# EAGLE design VCO (EAGLE 7.5.0)
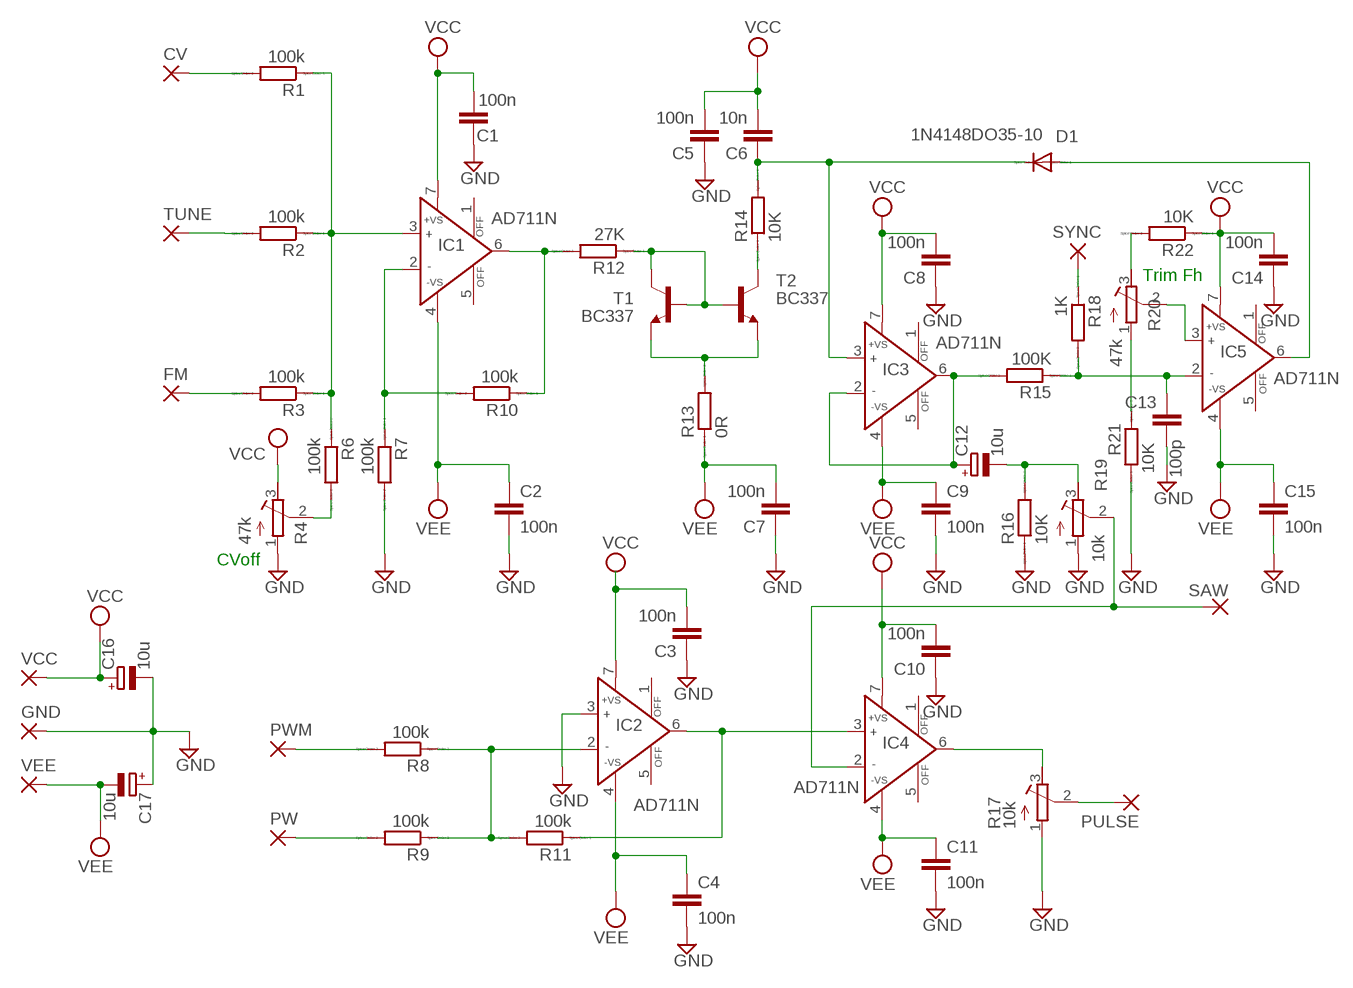
[diagram p0: schematic, sheet 1]

## Parts
C1  100n  C5/2.5  [C5B2.5]
C2  100n  C5/2.5  [C5B2.5]
C3  100n  C5/2.5  [C5B2.5]
C4  100n  C5/2.5  [C5B2.5]
C5  100n  C5/2.5  [C5B2.5]
C6  10n  C5/2.5  [C5B2.5]
C7  100n  C5/2.5  [C5B2.5]
C8  100n  C5/2.5  [C5B2.5]
C9  100n  C5/2.5  [C5B2.5]
C10  100n  C5/2.5  [C5B2.5]
C11  100n  C5/2.5  [C5B2.5]
C12  10u  CPOL-EUE2.5-7  [E2,5-7]
C13  100p  C2.5/2  [C2.5-2]
C14  100n  C5/2.5  [C5B2.5]
C15  100n  C5/2.5  [C5B2.5]
C16  10u  CPOL-EUE2.5-7  [E2,5-7]
C17  10u  CPOL-EUE2.5-7  [E2,5-7]
CV  3,17/1,1  [3,17/1,1]
D1  1N4148DO35-10  [DO35-10]
FM  3,17/1,1  [3,17/1,1]
GND  3,17/1,1  [3,17/1,1]
IC1  AD711N  [DIL08]
IC2  AD711N  [DIL08]
IC3  AD711N  [DIL08]
IC4  AD711N  [DIL08]
IC5  AD711N  [DIL08]
PULSE  3,17/1,1  [3,17/1,1]
PW  3,17/1,1  [3,17/1,1]
PWM  3,17/1,1  [3,17/1,1]
R1  100k  R0207/10  [0207/10]
R2  100k  R0207/10  [0207/10]
R3  100k  R0207/10  [0207/10]
R4  47k  R-TRIMM64W  [RTRIM64W]
R6  100k  R0207/10  [0207/10]
R7  100k  R0207/10  [0207/10]
R8  100k  R0207/10  [0207/10]
R9  100k  R0207/10  [0207/10]
R10  100k  R0207/10  [0207/10]
R11  100k  R0207/10  [0207/10]
R12  27K  R0207/10  [0207/10]
R13  0R  R0207/10  [0207/10]
R14  10K  R0207/10  [0207/10]
R15  100K  R0207/10  [0207/10]
R16  10K  R0207/10  [0207/10]
R17  10k  R-TRIMM3339P  [RTRIM3339P]
R18  1K  R0207/10  [0207/10]
R19  10k  R-TRIMM3339P  [RTRIM3339P]
R20  47k  R-TRIMM64W  [RTRIM64W]
R21  10K  R0207/10  [0207/10]
R22  10K  R0207/10  [0207/10]
SAW  3,17/1,1  [3,17/1,1]
SYNC  3,17/1,1  [3,17/1,1]
T1  BC337  [TO92]
T2  BC337  [TO92]
TUNE  3,17/1,1  [3,17/1,1]
VCC  3,17/1,1  [3,17/1,1]
VEE  3,17/1,1  [3,17/1,1]

## Nets
GND [Power]: C1.1 C2.2 C3.1 C4.2 C5.1 C7.1 C8.1 C9.2 C10.1 C11.2 C13.1 C14.1 C15.2 C16.- C17.+ GND.1(P) IC2.3(IN+) R4.1(A) R7.2 R16.1 R17.1(A) R19.1(A) R21.1
N$1: R12.1 T1.2(B) T1.3(C) T2.2(B)
N$2: R13.2 T1.1(E) T2.1(E)
N$3: C6.1 D1.C IC3.3(IN+) R14.2
N$4: R14.1 T2.3(C)
N$5: D1.A IC5.6(OUT)
N$6: IC5.3(IN+) R20.2(S)
N$7: C13.2 IC5.2(IN-) R15.1 R18.2
N$8: C12.+ IC3.2(IN-) IC3.6(OUT) R15.2
N$9: R20.1(A) R21.2
N$10: R4.2(S) R6.2
N$11: R20.3(E) R22.2
N$12: CV.1(P) R1.2
N$13: IC1.3(IN+) R1.1 R2.1 R3.1 R6.1
N$14: FM.1(P) R3.2
N$15: R18.1 SYNC.1(P)
N$17: R2.2 TUNE.1(P)
N$18: IC1.6(OUT) R10.1 R12.2
N$20: IC1.2(IN-) R7.1 R10.2
N$21: IC4.2(IN-) R19.2(S) SAW.1(P)
N$22: IC4.6(OUT) R17.3(E)
N$23: PULSE.1(P) R17.2(S)
N$24: IC2.2(IN-) R8.1 R9.1 R11.2
N$25: C12.- R16.2 R19.3(E)
N$27: PWM.1(P) R8.2
N$28: PW.1(P) R9.2
N$29: IC2.6(OUT) IC4.3(IN+) R11.1
VCC [Power]: C1.2 C3.2 C5.2 C6.2 C8.2 C10.2 C14.2 C16.+ IC1.7(+VS) IC2.7(+VS) IC3.7(+VS) IC4.7(+VS) IC5.7(+VS) R4.3(E) R22.1 VCC.1(P)
VEE [Power]: C2.1 C4.1 C7.2 C9.1 C11.1 C15.1 C17.- IC1.4(-VS) IC2.4(-VS) IC3.4(-VS) IC4.4(-VS) IC5.4(-VS) R13.1 VEE.1(P)
Unconnected: IC1.1(OFF) IC1.5(OFF) IC2.1(OFF) IC2.5(OFF) IC3.1(OFF) IC3.5(OFF) IC4.1(OFF) IC4.5(OFF) IC5.1(OFF) IC5.5(OFF)

## Notes on the sheet
- Trim Fh
- CVoff

## Library data of the parts
C1-C11 C13-C15 = capacitor-wima:C: CAPACITOR naming: grid - package width
C12 C16 C17 = rcl:CPOL-EU: POLARIZED CAPACITOR, European symbol
CV FM GND PULSE PW PWM SAW SYNC TUNE VCC VEE = wirepad:3,17/1,1: THROUGH-HOLE PAD
D1 = diode:1N4148: DIODE high speed (Philips)
IC1-IC5 = analog-devices:AD711: Precision, Low Cost, High Speed, BiFET Op Amp Source: http://www.analog.com/static/imported-files/data_sheets/AD711.pdf; MPN: AD711BQ; OC_FARNELL: 9604839; OC_NEWARK: 66F5826
R1-R3 R6-R12 = eagle-ltspice:R: RESISTOR, European symbol; SPICEMODEL: NONE; SPICEPREFIX: 27K
R4 R20 = rcl:R-TRIMM: Trimm resistor
R13 = eagle-ltspice:R: RESISTOR, European symbol; SPICEMODEL: NONE; SPICEPREFIX: R
R14 R16 R21 R22 = eagle-ltspice:R: RESISTOR, European symbol; SPICEMODEL: NONE; SPICEPREFIX: 10K
R15 R18 = eagle-ltspice:R: RESISTOR, European symbol; SPICEMODEL: NONE
R17 R19 = resistor:R-TRIMM: Trimm resistor
T1 T2 = transistor:BC337: NPN TRANSISTOR

## Net classes
0 default: width 0.508 mm, clearance 0.508 mm
1 Power: width 1.016 mm, clearance 0.508 mm

## Board
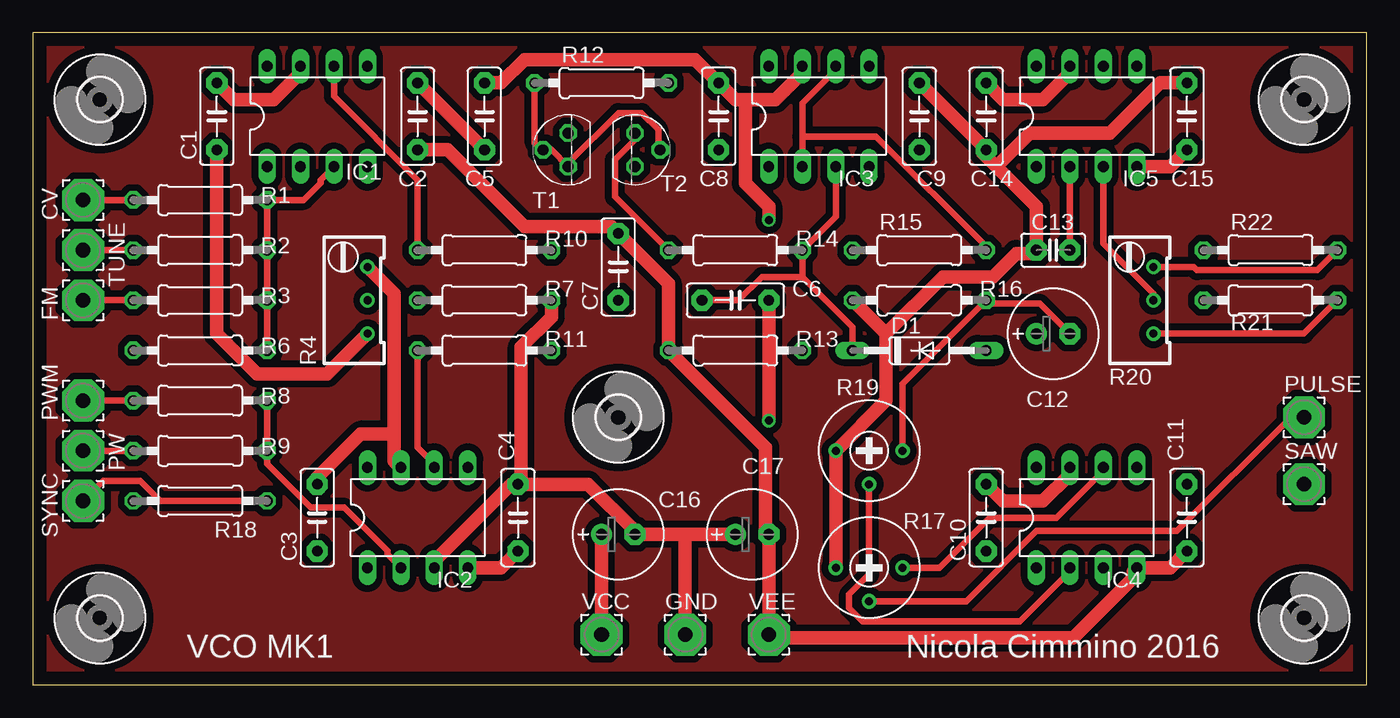
[diagram p1: board, top side]
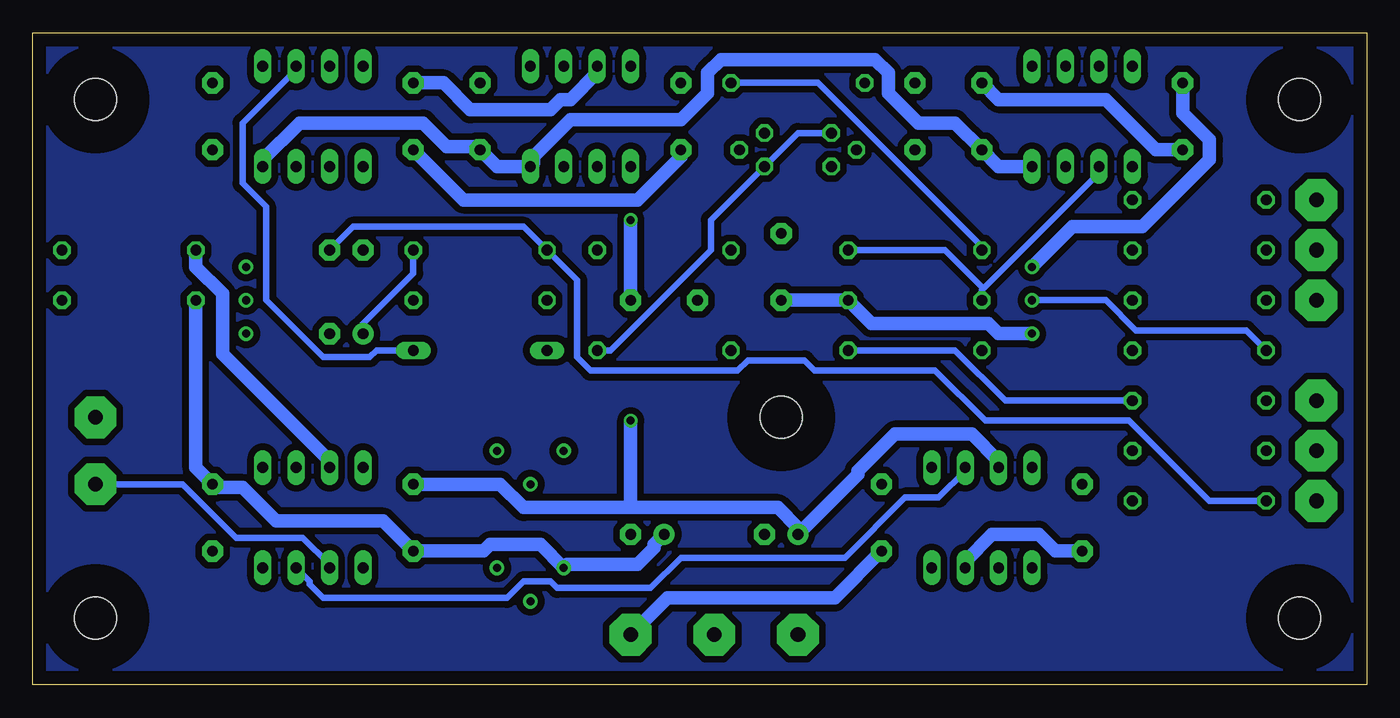
[diagram p2: board, bottom side, seen from below]

Size 101.27 x 49.52 mm. Coordinates in mm from the lower left corner, seen from the top.
Outline: 0,0 101.27,0 101.27,49.52 0,49.52 0,0
Copper layers (1*16): Top 0.035mm / dielectric 1.5mm / Bottom 0.035mm
Design rules "default": minimum track width 10mil, minimum drill 24mil, track to track 8mil, track to pad 8mil, pad to pad 8mil, via to via 8mil, smd to smd 8mil, copper to edge 40mil, drill to drill 8mil, minimum pad ring 10mil, minimum via ring 8mil, stop-mask expansion 4mil, vias tented up to drill 0mil, thermal gap 10mil

### Footprints (pad centres in the part's own frame; a part is rotated, then mirrored left to right if it is on the bottom)
C5B2.5 = drill 0.813 pad 1.6 octagon: 1 -2.54,0; 2 2.54,0
E2,5-7 = drill 0.813 pad 1.6: + -1.27,0 | drill 0.813 pad 1.6 octagon: - 1.27,0
C2.5-2 = drill 0.813 pad 1.6 octagon: 1 -1.27,0; 2 1.27,0
3,17/1,1 = drill 1.118 pad 3.175 octagon: 1 0,0
DO35-10 = drill 0.813 long: A 5.08,0; C -5.08,0
DIL08 = drill 0.813 long: 1 -3.81,-3.81; 2 -1.27,-3.81; 3 1.27,-3.81; 4 3.81,-3.81; 5 3.81,3.81; 6 1.27,3.81; 7 -1.27,3.81; 8 -3.81,3.81
0207/10 = drill 0.813 octagon: 1 -5.08,0; 2 5.08,0
RTRIM64W = drill 0.61: 1 1.27,-2.54; 2 1.27,0; 3 1.27,2.54
RTRIM3339P = drill 0.61: 1 -2.54,0; 2 0,-2.54; 3 2.54,0
TO92 = drill 0.813 octagon: 1 1.27,0; 2 0,1.905; 3 -1.27,0
3,2 = hole 3.2: 0,0

### Placement (x,y rotation side)
C1  13.97,43.18 90 top
C2  29.21,43.18 90 top
C3  21.59,12.7 90 top
C4  36.83,12.7 90 top
C5  34.29,43.18 90 top
C6  53.34,29.21 0 top
C7  44.45,31.75 90 top
C8  52.07,43.18 90 top
C9  67.31,43.18 90 top
C10  72.39,12.7 90 top
C11  87.63,12.7 90 top
C12  77.47,26.67 0 top
C13  77.47,33.02 0 top
C14  72.39,43.18 90 top
C15  87.63,43.18 90 top
C16  44.45,11.43 0 top
C17  54.61,11.43 0 top
CV  3.81,36.83 0 top
D1  67.31,25.4 0 top
FM  3.81,29.21 0 top
GND  49.53,3.81 0 top
IC1  21.59,43.18 0 top
IC2  29.21,12.7 0 top
IC3  59.69,43.18 0 top
IC4  80.01,12.7 0 top
IC5  80.01,43.18 0 top
PULSE  96.52,20.32 0 top
PW  3.81,17.78 0 top
PWM  3.81,21.59 0 top
R1  12.7,36.83 180 top
R2  12.7,33.02 180 top
R3  12.7,29.21 180 top
R4  24.13,29.21 0 top
R6  12.7,25.4 180 top
R7  34.29,29.21 0 top
R8  12.7,21.59 180 top
R9  12.7,17.78 180 top
R10  34.29,33.02 0 top
R11  34.29,25.4 0 top
R12  43.18,45.72 0 top
R13  53.34,25.4 0 top
R14  53.34,33.02 0 top
R15  67.31,33.02 0 top
R16  67.31,29.21 0 top
R17  63.5,8.89 0 top
R18  12.7,13.97 180 top
R19  63.5,17.78 0 top
R20  83.82,29.21 0 top
R21  93.98,29.21 0 top
R22  93.98,33.02 0 top
SAW  96.52,15.24 0 top
SYNC  3.81,13.97 0 top
T1  40.64,40.64 90 top
T2  45.72,40.64 270 top
TUNE  3.81,33.02 0 top
U$1  [3,2]  5.08,44.45 0 top
U$2  [3,2]  5.08,5.08 0 top
U$3  [3,2]  96.52,44.45 0 top
U$4  [3,2]  96.52,5.08 0 top
U$5  [3,2]  44.45,20.32 0 top
VCC  43.18,3.81 0 top
VEE  55.88,3.81 0 top

### Tracks (layer width: path | path; a pad name or v marks a point on that pad's centre or on a via)
GND
  Top 1.016: C2.2 C5.1 | IC2.3 30.48,9.4 36.32,15.24 C4.2 | R7.2 39.37,27.94 37.08,25.65 37.08,15.49 C4.2 | C1.1 13.97,26.67 17.02,23.62 22.35,23.62 R4.1 | C9.2 C14.1 72.14,40.39 73.15,39.37 | 73.15,39.37 76.2,36.32 C13.1 75.95,32.77 74.68,32.77 72.9,30.99 69.09,30.99 64.77,26.67 | C15.2 85.6,45.72 81.79,41.91 75.69,41.91 73.15,39.37 | C17.+ 49.53,11.43 | 49.53,11.43 C16.- 45.72,11.68 42.16,15.24 C4.2 | GND.1 49.53,11.43 | R17.1 R19.1 64.77,21.59 64.77,26.67 | 64.77,26.67 R16.1
  Bottom 1.016: C1.1 16,40.64 19.81,44.45 27.94,44.45 C2.2 | R4.1 27.94,26.67 28.7,27.43 37.59,27.43 R7.2 C7.1 | C3.1 23.62,10.16 24.89,11.43 28.45,11.43 30.48,9.4 IC2.3 | C8.1 52.07,40.13 55.37,36.83 68.58,36.83 C14.1 | R21.1 88.9,16.51 C11.2 87.38,14.99 85.34,14.99 82.8,12.45 74.68,12.45 C10.1 67.06,10.16 66.55,10.67 62.74,10.67 R17.1 60.71,9.14 55.37,9.14 54.1,10.41 54.1,10.67 C17.+
N$1
  Top 0.508: R12.1 38.1,41.15 38.61,40.64 T1.2 39.37,40.64 T1.3 40.64,39.62 44.45,43.43 46.23,43.43 47.5,42.16 47.5,40.64 T2.2
N$2
  Bottom 0.508: R13.2 57.4,25.4 49.78,33.02 49.78,35.31 T2.1 43.18,41.91 T1.1
N$3
  Top 0.508: D1.C 62.23,27.18 58.42,30.99 | 58.42,30.99 R14.2 60.96,35.56 IC3.3 | C6.1 53.59,29.21 55.37,30.99 58.42,30.99
N$4
  Top 0.508: T2.3 45.72,41.4 44.2,39.88 44.2,37.08 R14.1
N$5
  Bottom 0.508: D1.A 75.18,25.4 75.69,24.89 79.25,24.89 83.57,29.21 83.57,36.32 85.34,38.1 85.34,42.67 81.28,46.74 IC5.6
N$6
  Top 0.508: R20.2 85.09,29.72 81.28,33.53 IC5.3
N$7
  Top 0.508: C13.2 IC5.2
  Bottom 0.508: R18.2 11.94,13.97 18.03,20.07 28.96,20.07 32.77,23.88 41.91,23.88 42.67,24.64 46.99,24.64 47.75,23.88 58.93,23.88 59.94,24.89 59.94,30.73 R15.1 64.01,34.8 76.96,34.8 C13.2
N$8
  Top 0.508: 58.42,41.66 58.42,44.2 60.96,46.74 IC3.6 | 58.42,41.66 IC3.2 | 58.42,41.66 64.01,41.66 72.39,33.27 R15.2
  Bottom 0.508: R15.2 72.39,31.24 76.2,27.43 C12.+
N$9
  Top 0.508: R20.1 96.52,26.67 R21.2
N$10
  Bottom 0.508: R4.2 19.81,29.21 17.53,26.92 9.14,26.92 R6.2
N$11
  Top 0.508: R20.3 88.14,31.75 88.39,31.5 97.54,31.5 R22.2
N$12
  Top 0.508: CV.1 R1.2
N$13
  Top 0.508: R6.1 R3.1 R2.1 R1.1 20.57,36.83 21.84,38.1 21.84,38.35 IC1.3
N$14
  Top 0.508: FM.1 R3.2
N$15
  Top 0.508: R18.1 9.65,13.97 8.13,15.49 5.33,15.49 SYNC.1
N$16
  pour Top: 0,49.53 101.6,49.53 101.6,0 0,0
N$17
  Top 0.508: TUNE.1 R2.2
N$18
  Top 0.508: IC1.6 22.86,44.7 29.21,38.35 R10.1
  Bottom 0.508: R12.2 41.66,45.72 29.21,33.27 R10.1
N$19
  pour Bottom: 0,49.53 101.6,49.53 101.6,0 0,0 0,2.54
N$20
  Bottom 0.508: IC1.2 20.32,38.86 29.08,30.1 | 29.08,30.1 29.21,29.97 R7.1 | R10.2 32,33.02 29.08,30.1
N$21
  Top 0.508: R19.2 63.5,8.38 61.98,6.86 61.98,5.84 62.99,4.83 74.93,4.83 78.74,8.64 IC4.2
  Bottom 0.508: SAW.1 89.92,15.24 85.85,11.18 80.77,11.18 78.74,9.14 IC4.2
N$22
  Top 0.508: R17.3 68.83,8.89 72.64,12.7 77.72,12.7 81.28,16.26 IC4.6
N$23
  Top 0.508: R17.2 70.87,6.35 76.2,11.68 86.87,11.68 95.5,20.32 PULSE.1
N$24
  Top 0.508: IC2.2 26.92,9.91 26.92,10.16 23.62,13.46 21.08,13.46 17.78,16.76 R9.1 R8.1
  Bottom 0.508: R11.2 31.24,25.4 27.43,21.59 R8.1
N$25
  Top 0.508: R19.3 66.04,22.86 R16.2 72.39,28.96 76.45,28.96 C12.-
N$27
  Top 0.508: PWM.1 R8.2
N$28
  Top 0.508: PW.1 R9.2
N$29
  Top 0.508: R11.1 29.21,18.03 30.48,16.76 IC2.6
  Bottom 0.508: IC4.3 80.26,7.87 80.26,7.62 79.25,6.6 65.28,6.6 64.01,7.87 61.98,7.87 61.47,7.37 54.36,7.37 52.07,9.65 39.62,9.65 35.05,14.22 32.51,14.22 30.48,16.26 IC2.6
VCC  (via drill 0.61)
  Top 1.016: IC5.7 78.74,46.48 76.71,44.45 73.66,44.45 C14.2 | IC3.7 58.42,46.48 56.39,44.45 54.1,44.45 | 54.1,44.45 53.34,44.45 C8.2 50.29,47.5 37.34,47.5 35.56,45.72 C5.2 | v55.88,35.31 55.88,36.32 54.1,38.1 54.1,44.45 | IC4.7 78.74,16 76.71,13.97 73.66,13.97 C10.2 | VCC.1 C16.+ | IC1.7 20.32,46.48 18.29,44.45 15.24,44.45 C1.2 | R4.3 27.43,29.72 27.43,19.05 | 27.43,19.05 27.43,17.02 IC2.7 | C3.2 21.59,15.75 24.89,19.05 27.43,19.05 | v55.88,20.07 C6.2
  Bottom 1.016: v55.88,35.31 C6.2 | C14.2 70.1,45.72 68.07,43.69 61.98,43.69 61.21,44.45 60.45,44.45 58.42,46.48 IC3.7 | R22.1 88.9,31.75 86.87,29.72 86.87,25.15 78.74,17.02 IC4.7 | C1.2 13.97,43.43 11.94,41.4 11.94,39.88 17.02,34.8 22.35,34.8 R4.3 | IC2.7 27.94,17.02 29.97,19.05 35.81,19.05 38.61,16.26 38.61,16 C16.+ 43.18,11.94 44.7,13.46 55.88,13.46 | C10.2 65.79,15.24 64.01,13.46 55.88,13.46 | 55.88,13.46 v55.88,20.07
VEE
  Top 1.016: C11.1 86.36,8.89 IC4.4 83.57,8.64 83.57,8.13 78.99,3.56 56.13,3.56 VEE.1 C17.- 55.63,11.68 55.63,18.03 R13.1 48.26,30.48 C7.2 43.94,34.8 37.34,34.8 31.5,40.64 C2.1 | IC2.4 35.56,8.89 C4.1 | IC5.4 86.36,39.37 C15.1
  Bottom 1.016: C4.1 40.39,6.6 53.09,6.6 VEE.1 | IC5.4 83.82,39.88 81.03,42.67 71.63,42.67 69.85,40.89 67.56,40.89 C9.1 66.04,39.37 IC3.4 63.25,39.62 63.25,40.13 60.45,42.93 52.07,42.93 50.04,44.96 50.04,46.48 49.02,47.5 37.34,47.5 36.32,46.48 36.32,44.96 34.04,42.67 31.24,42.67 C2.1 27.94,39.37 IC1.4

### Text on the board
tNames: VCO MK1 | Nicola Cimmino 2016